# Altium schematic sheet CONNECTS.SchDoc: Carte mère embarquée - Ports
size A3; Author: B.Labbe; CompanyName: Oufffteam; DrawnBy: B.Labbe; Engineer: B.Labbe; Organization: Oufffteam; Revision: A; SheetNumber: 2; SheetTotal: 6; DocumentName: Carte mère embarquée - Ports
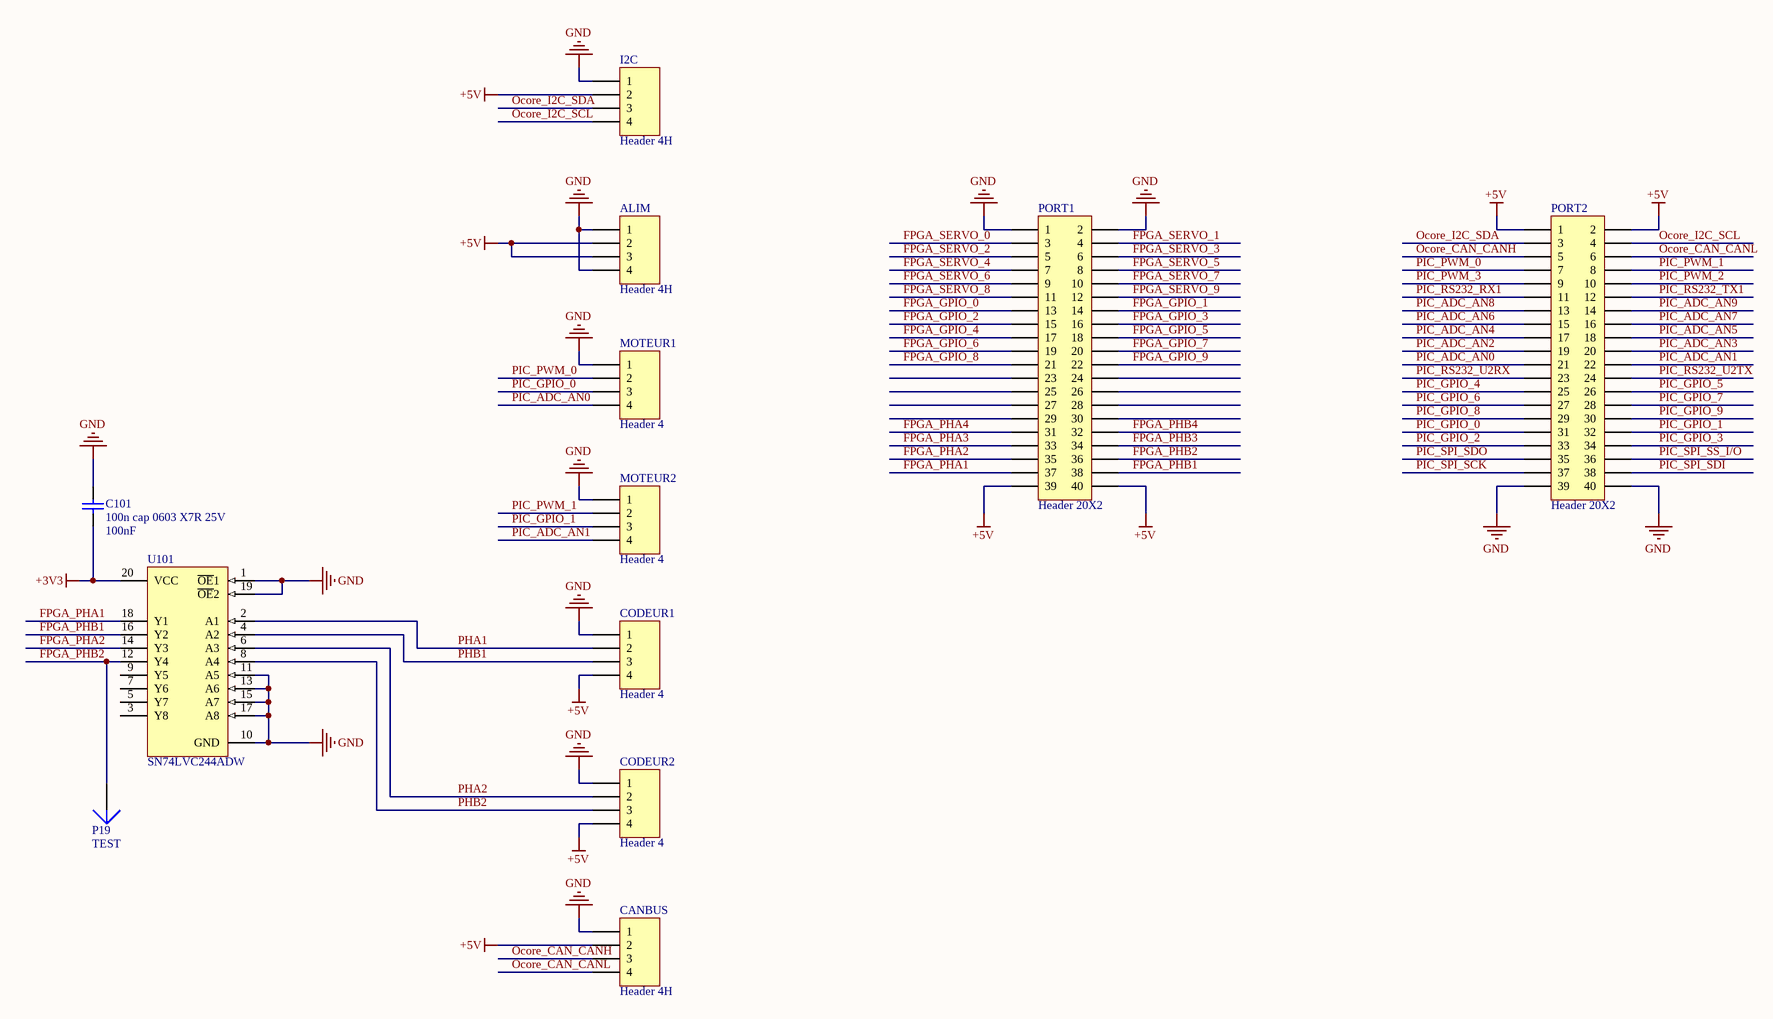
[diagram p0: CONNECTS.SchDoc]

## Parts
ALIM  Header 4H  [HDR1X4H]
C101  100n cap 0603 X7R 25V  value 100nF  [1608[0603]]  (graphical)
CANBUS  Header 4H  [HDR1X4H]
CODEUR1  Header 4  [HDR1X4]  (graphical)
CODEUR2  Header 4  [HDR1X4]  (graphical)
I2C  Header 4H  [HDR1X4H]
MOTEUR1  Header 4  [HDR1X4]  (graphical)
MOTEUR2  Header 4  [HDR1X4]  (graphical)
P19  TEST  [TP1]  (graphical)
PORT1  Header 20X2  [HDR2X20]
PORT2  Header 20X2  [HDR2X20]
U101  SN74LVC244ADW  [DW020_N]  (graphical)

## Nets
+3V3: C101.1 U101.20(VCC)
+5V: ALIM.2 ALIM.3 CANBUS.2 CODEUR1.4 CODEUR2.4 I2C.2 PORT1.39 PORT1.40 PORT2.1 PORT2.2
GND: ALIM.1 ALIM.4 C101.2 CANBUS.1 CODEUR1.1 CODEUR2.1 I2C.1 MOTEUR1.1 MOTEUR2.1 PORT1.1 PORT1.2 PORT2.39 PORT2.40 U101.1(~{OE}1) U101.10(GND) U101.11(A5) U101.13(A6) U101.15(A7) U101.17(A8) U101.19(~{OE}2)
FPGA_GPIO_0: PORT1.13
FPGA_GPIO_1: PORT1.14
FPGA_GPIO_2: PORT1.15
FPGA_GPIO_3: PORT1.16
FPGA_GPIO_4: PORT1.17
FPGA_GPIO_5: PORT1.18
FPGA_GPIO_6: PORT1.19
FPGA_GPIO_7: PORT1.20
FPGA_GPIO_8: PORT1.21
FPGA_GPIO_9: PORT1.22
FPGA_PHA1: PORT1.37 U101.18(Y1)
FPGA_PHA2: PORT1.35 U101.14(Y3)
FPGA_PHA3: PORT1.33
FPGA_PHA4: PORT1.31
FPGA_PHB1: PORT1.38 U101.16(Y2)
FPGA_PHB2: P19.1 PORT1.36 U101.12(Y4)
FPGA_PHB3: PORT1.34
FPGA_PHB4: PORT1.32
FPGA_SERVO_0: PORT1.3
FPGA_SERVO_1: PORT1.4
FPGA_SERVO_2: PORT1.5
FPGA_SERVO_3: PORT1.6
FPGA_SERVO_4: PORT1.7
FPGA_SERVO_5: PORT1.8
FPGA_SERVO_6: PORT1.9
FPGA_SERVO_7: PORT1.10
FPGA_SERVO_8: PORT1.11
FPGA_SERVO_9: PORT1.12
Ocore_CAN_CANH: CANBUS.3 PORT2.5
Ocore_CAN_CANL: CANBUS.4 PORT2.6
Ocore_I2C_SCL: I2C.4 PORT2.4
Ocore_I2C_SDA: I2C.3 PORT2.3
PHA1: CODEUR1.2 U101.2(A1)
PHA2: CODEUR2.2 U101.6(A3)
PHB1: CODEUR1.3 U101.4(A2)
PHB2: CODEUR2.3 U101.8(A4)
PIC_ADC_AN0: MOTEUR1.4 PORT2.21
PIC_ADC_AN1: MOTEUR2.4 PORT2.22
PIC_ADC_AN2: PORT2.19
PIC_ADC_AN3: PORT2.20
PIC_ADC_AN4: PORT2.17
PIC_ADC_AN5: PORT2.18
PIC_ADC_AN6: PORT2.15
PIC_ADC_AN7: PORT2.16
PIC_ADC_AN8: PORT2.13
PIC_ADC_AN9: PORT2.14
PIC_GPIO_0: MOTEUR1.3 PORT2.31
PIC_GPIO_1: MOTEUR2.3 PORT2.32
PIC_GPIO_2: PORT2.33
PIC_GPIO_3: PORT2.34
PIC_GPIO_4: PORT2.25
PIC_GPIO_5: PORT2.26
PIC_GPIO_6: PORT2.27
PIC_GPIO_7: PORT2.28
PIC_GPIO_8: PORT2.29
PIC_GPIO_9: PORT2.30
PIC_PWM_0: MOTEUR1.2 PORT2.7
PIC_PWM_1: MOTEUR2.2 PORT2.8
PIC_PWM_2: PORT2.10
PIC_PWM_3: PORT2.9
PIC_RS232_RX1: PORT2.11
PIC_RS232_TX1: PORT2.12
PIC_RS232_U2RX: PORT2.23
PIC_RS232_U2TX: PORT2.24
PIC_SPI_SCK: PORT2.37
PIC_SPI_SDI: PORT2.38
PIC_SPI_SDO: PORT2.35
PIC_SPI_SS_I/O: PORT2.36

Not connected (* = marked no-connect by the designer): PORT1 23 24 25 26 27 28 29 30; U101 3(Y8) 5(Y7) 7(Y6) 9(Y5)

## Notes on the sheet
- Title
- Size:
- Date:
- A3
- Number:
- Time:
- Revision:
- Sheet
- of
- Oufffteam
- 3 place Carnot
- 26100
- Romans sur Isère
- oufffteam@gmail.com
- File:

## Library data of the parts
ALIM CANBUS I2C = Header 4H: Header, 4-Pin, Right Angle; LatestRevisionDate: 17-Jul-2002; LatestRevisionNote: Re-released for DXP Platform.; Publisher: Altium Limited
C101 = Cap: Capacitor; Published: 8-Jun-2000; LatestRevisionDate: 17-Jul-2002; LatestRevisionNote: Re-released for DXP Platform.; PackageReference: RAD-0.3; Publisher: Altium Limited
CODEUR1 CODEUR2 MOTEUR1 MOTEUR2 = Header 4: Header, 4-Pin; LatestRevisionDate: 17-Jul-2002; LatestRevisionNote: Re-released for DXP Platform.; Publisher: Altium Limited
P19 = Plug: LatestRevisionDate: 17-Jul-2002; LatestRevisionNote: Re-released for DXP Platform.; Publisher: Altium Limited
PORT1 PORT2 = Header 20X2: Header, 20-Pin, Dual row; LatestRevisionDate: 17-Jul-2002; LatestRevisionNote: Re-released for DXP Platform.; Publisher: Altium Limited
U101 = SN74LVC244ADW: Octal Buffer/Driver with 3-State Outputs; Published: 8-Jun-2000; LatestRevisionDate: 13-Apr-2006; LatestRevisionNote: IPC-7351 Footprint Added.; DatasheetVersion: Apr-1999; PackageVersion: Mar-2000; PackageReference: DW020; Publisher: Altium Limited; PackageDescription: 20-Pin Plastic Small Outline Integrated Circuit 1.27 mm Pitch; Code_JEDEC: MS-013; Code_IPC: SOIC127P1030-20; ComponentLink1Description: Manufacturer Link; ComponentLink1URL: http://www.ti.com/; ComponentLink2Description: Datasheet; ComponentLink2URL: http://www-s.ti.com/sc/ds/sn74lvc244a.pdf